# EAGLE design BOTTOM_BRD_v.1.0.2_ (EAGLE 9.6.2)
NYU Shanghai Swarm Robotics 2020
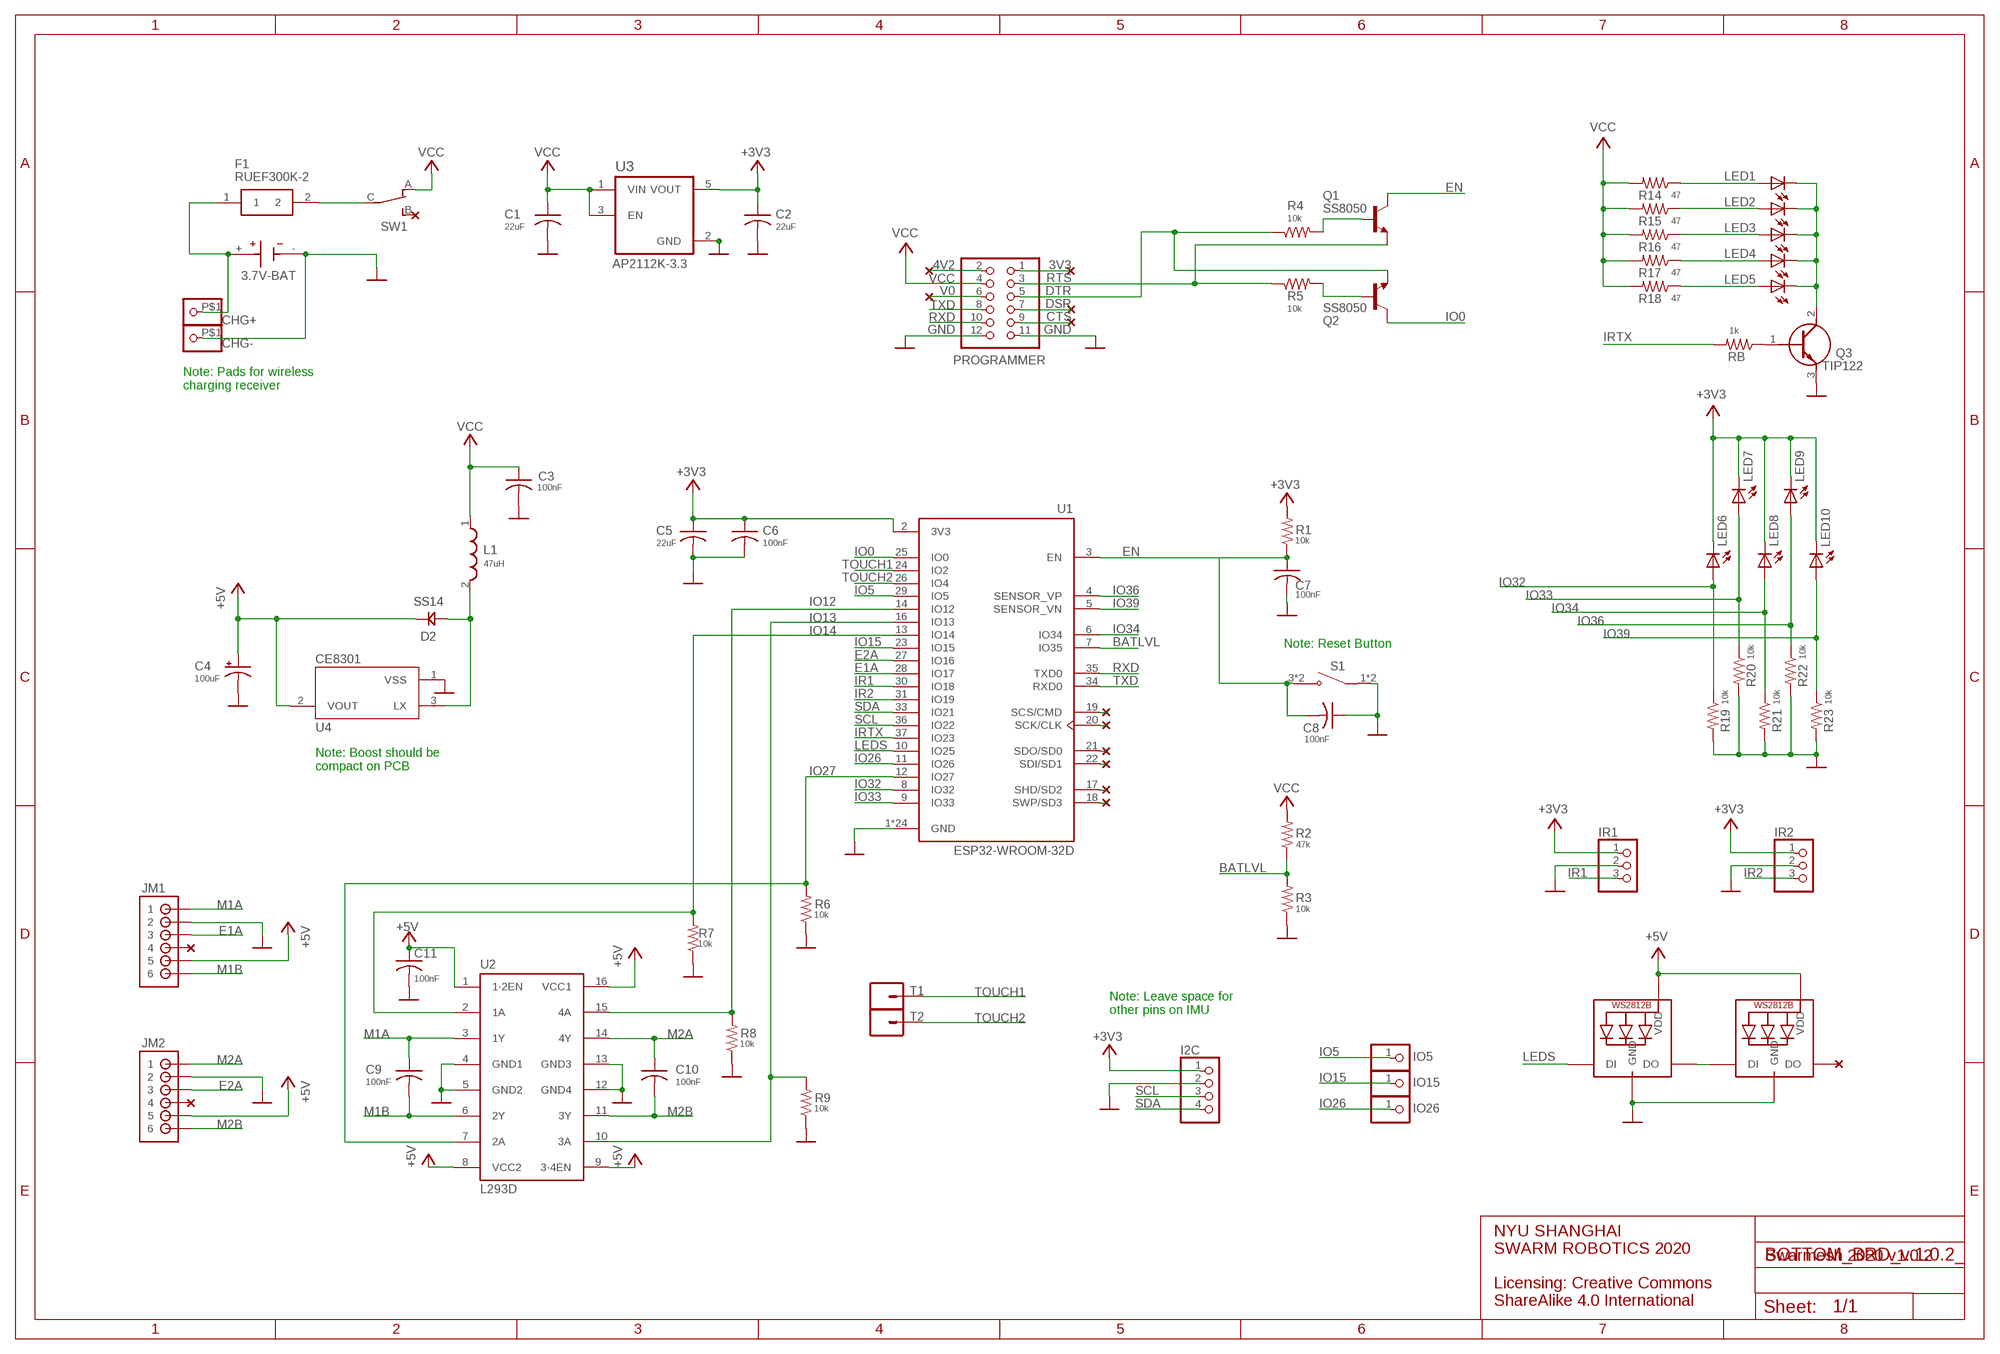
[diagram p0: schematic, sheet 1]

## Parts
BT1  3.7V-BAT  6S-AA  [BAT_6S-AA]
C1  22uF  C-USC0805  [C0805]
C2  22uF  C-USC0805  [C0805]
C3  100nF  C-USC0805  [C0805]
C4  100uF  CPOL-US153CLV-0605  [153CLV-0605]
C5  22uF  C-USC0805  [C0805]
C6  100nF  C-USC0805  [C0805]
C7  100nF  C-USC0805  [C0805]
C8  100nF  C-USC0805  [C0805]
C9  100nF  C-USC0805  [C0805]
C10  100nF  C-USC0805  [C0805]
C11  100nF  C-USC0805  [C0805]
CHARGING  WS2812B5050  [WS2812B]
CHG+  PINHD-1X1-BIGPOGO  [1X1-BIGPOGO]
CHG-  PINHD-1X1-BIGPOGO  [1X1-BIGPOGO]
D2  SS14  [DO214]
F1  RUEF300K-2  [RUEF300K2]
I2C  PINHD-1X4  [1X04]
IO5  PINHD-1X1  [1X01]
IO15  PINHD-1X1  [1X01]
IO26  PINHD-1X1  [1X01]
IR1  PINHD-1X3  [1X03]
IR2  PINHD-1X3  [1X03]
JM1  B6B-ZR  [B6B-ZR]
JM2  B6B-ZR  [B6B-ZR]
L1  47uH  SDR0604-100KL  [INDP5858X480N]
LED1  LED5MM  [LED5MM]
LED2  LED5MM  [LED5MM]
LED3  LED5MM  [LED5MM]
LED4  LED5MM  [LED5MM]
LED5  LED5MM  [LED5MM]
LED6  LED5MM  [LED5MM]
LED7  LED5MM  [LED5MM]
LED8  LED5MM  [LED5MM]
LED9  LED5MM  [LED5MM]
LED10  LED5MM  [LED5MM]
PROGRAMMER  PINHD-2X6  [2X06]
Q1  SS8050  BC850  [SOT23]
Q2  SS8050  BC850  [SOT23]
Q3  TIP122  [TO270P460X1020X2008-3P]
R1  10k  R-US_M0805  [M0805]
R2  47k  R-US_M0805  [M0805]
R3  10k  R-US_M0805  [M0805]
R4  10k  R-US_M0805  [M0805]
R5  10k  R-US_M0805  [M0805]
R6  10k  R-US_M0805  [M0805]
R7  10k  R-US_M0805  [M0805]
R8  10k  R-US_M0805  [M0805]
R9  10k  R-US_M0805  [M0805]
R14  47  R-US_M0805  [M0805]
R15  47  R-US_M0805  [M0805]
R16  47  R-US_M0805  [M0805]
R17  47  R-US_M0805  [M0805]
R18  47  R-US_M0805  [M0805]
R19  10k  R-US_M0805  [M0805]
R20  10k  R-US_M0805  [M0805]
R21  10k  R-US_M0805  [M0805]
R22  10k  R-US_M0805  [M0805]
R23  10k  R-US_M0805  [M0805]
RB  1k  R-US_M0805  [M0805]
S1  2-1437565-9  [SW_2-1437565-9]
STATE  WS2812B5050  [WS2812B]
SW1  CS12ANW03  [CS12ANW03]
T1  CONN_01SPRING-CONN  [SPRING-CONNECTOR]
T2  CONN_01SPRING-CONN  [SPRING-CONNECTOR]
U1  ESP32-WROOM-32D  [MODULE_ESP32-WROOM-32D]
U2  L293D  [DIL16]
U3  AP2112K-3.3  AP2112K-3.3TRG1  [SOT95P285X140-5N]
U4  CE8301  MCP1702T-3302E/MB  [REG_MCP1702T-3302E/MB]

## Nets
3V3: PROGRAMMER.1
4V2: PROGRAMMER.2
+3V3: C2.1 C5.1 C6.1 I2C.1 IR1.1 IR2.1 LED6.K(C) LED7.K(C) LED8.K(C) LED9.K(C) LED10.K(C) R1.2 U1.2(3V3) U3.5(VOUT)
+5V: C4.+ C11.1 CHARGING.1-VDD(VDD) D2.CATHODE(KATHODE) JM1.5 JM2.5 STATE.1-VDD(VDD) U2.1(1-2EN) U2.8(VCC2) U2.9(3-4EN) U2.16(VCC1) U4.2(VOUT)
BATLVL: R2.1 R3.2 U1.7(IO35)
CTS: PROGRAMMER.9
DSR: PROGRAMMER.7
DTR: PROGRAMMER.5 Q2.2(E) R4.1
E1A: JM1.3 U1.28(IO17)
E2A: JM2.3 U1.27(IO16)
EN: C7.1 C8.2 Q1.3(C) R1.1 S1.3(NO) S1.4(NO) U1.3(EN)
GND: BT1.- C1.2 C2.2 C3.2 C4.- C5.2 C6.2 C7.2 C8.1 C11.2 CHARGING.3-GND(GND) CHG-.P$1 I2C.2 IR1.2 IR2.2 JM1.2 JM2.2 PROGRAMMER.11 PROGRAMMER.12 Q3.3(E) R3.1 R6.1 R7.1 R8.1 R9.1 R19.2 R20.2 R21.2 R22.2 R23.2 S1.1(COM) S1.2(COM) STATE.3-GND(GND) U1.1(GND) U1.15(GND) U1.38(GND) U1.39_1(GND) U1.39_2(GND) U1.39_3(GND) U1.39_4(GND) U1.39_5(GND) U1.39_6(GND) U1.39_7(GND) U1.39_8(GND) U1.39_9(GND) U1.39_10(GND) U1.39_11(GND) U1.39_12(GND) U1.39_13(GND) U1.39_14(GND) U1.39_15(GND) U1.39_16(GND) U1.39_17(GND) U1.39_18(GND) U1.39_19(GND) U1.39_20(GND) U1.39_21(GND) U2.4(GND1) U2.5(GND2) U2.12(GND4) U2.13(GND3) U3.2(GND) U4.1(VSS)
IO0: Q2.3(C) U1.25(IO0)
IO5: IO5.1 U1.29(IO5)
IO12: R8.2 U1.14(IO12) U2.15(4A)
IO13: R9.2 U1.16(IO13) U2.10(3A)
IO14: R7.2 U1.13(IO14) U2.2(1A)
IO15: IO15.1 U1.23(IO15)
IO26: IO26.1 U1.11(IO26)
IO27: R6.2 U1.12(IO27) U2.7(2A)
IO32: LED6.A R19.1 U1.8(IO32)
IO33: LED7.A R20.1 U1.9(IO33)
IO34: LED8.A R21.1 U1.6(IO34)
IO36: LED9.A R22.1 U1.4(SENSOR_VP)
IO39: LED10.A R23.1 U1.5(SENSOR_VN)
IR1: IR1.3 U1.30(IO18)
IR2: IR2.3 U1.31(IO19)
IRTX: RB.2 U1.37(IO23)
LEDS: CHARGING.4-DIN(DI) U1.10(IO25)
M1A: C9.1 JM1.1 U2.3(1Y)
M1B: C9.2 JM1.6 U2.6(2Y)
M2A: C10.1 JM2.1 U2.14(4Y)
M2B: C10.2 JM2.6 U2.11(3Y)
N$1: BT1.+ CHG+.P$1 F1.1
N$3: F1.2 SW1.C
N$4: D2.ANODE L1.2 U4.3(LX)
N$5: U1.19(SCS/CMD)
N$6: LED5.A R18.1
N$7: LED4.A R17.1
N$8: LED3.A R16.1
N$9: CHARGING.2-DOUT(DO) STATE.4-DIN(DI)
N$11: LED1.A R14.1
N$12: Q1.1(B) R4.2
N$14: LED2.A R15.1
N$15: Q2.1(B) R5.2
N$16: U1.20(SCK/CLK)
N$18: U1.21(SDO/SD0)
N$19: LED1.K(C) LED2.K(C) LED3.K(C) LED4.K(C) LED5.K(C) Q3.2(C)
N$23: U1.22(SDI/SD1)
N$24: U1.17(SHD/SD2)
N$25: U1.18(SWP/SD3)
N$26: Q3.1(B) RB.1
RTS: PROGRAMMER.3 Q1.2(E) R5.1
RXD: PROGRAMMER.10 U1.35(TXD0)
SCL: I2C.3 U1.36(IO22)
SDA: I2C.4 U1.33(IO21)
TOUCH1: T1.P$2 U1.24(IO2)
TOUCH2: T2.P$2 U1.26(IO4)
TXD: PROGRAMMER.8 U1.34(RXD0)
V0: PROGRAMMER.6
VCC: C1.1 C3.1 L1.1 PROGRAMMER.4 R2.2 R14.2 R15.2 R16.2 R17.2 R18.2 SW1.A U3.1(VIN) U3.3(EN)
Unconnected: JM1.4 JM2.4 STATE.2-DOUT(DO) SW1.B

## Notes on the sheet
- Note: Pads for wireless 
  charging receiver
- Note: Reset Button
- Note: Boost should be
  compact on PCB
- Note: Leave space for 
  other pins on IMU
- Swarmesh 2020 v1.0.2
- NYU SHANGHAI
  SWARM ROBOTICS 2020
  
  Licensing: Creative Commons
  ShareAlike 4.0 International

## Library data of the parts
BT1 = 6S-AA:6S-AA; AVAILABILITY: Unavailable; DESCRIPTION: BATTERY HOLDER AA PC PIN; DIGIKEY-PURCHASE-URL: https://snapeda.com/shop?store=DigiKey&id=4389101; MF: MPD; MP: 6S-AA; PACKAGE: None; PRICE: None
C1-C3 C5-C11 = rcl:C-US: CAPACITOR, American symbol; SPICEPREFIX: C
C4 = rcl:CPOL-US: POLARIZED CAPACITOR, American symbol; SPICEPREFIX: C
CHARGING STATE = adafruit:WS2812B
CHG+ CHG- = adafruit:PINHD-1X1: Pin header 1x1 for 0.1" spacing With round pins
D2 = SS14:SS14; AVAILABILITY: Unavailable; DESCRIPTION: Diode Schottky 40V 1A Surface Mount SMA (DO-214AC); DIGIKEY-PURCHASE-URL: https://snapeda.com/shop?store=DigiKey&id=229686; MF: ON Semiconductor; MP: SS14; PACKAGE: DO-214AC-214 ON Semiconductor; PRICE: None
F1 = RUEF300K-2:RUEF300K-2: TE CONNECTIVITY / RAYCHEM - RUEF300K-2 - RESETTABLE FUSE, PTC, 30V, 3A, RADIAL Source: Datasheet <http://www.farnell.com/datasheets/1482689.pdf>; DESCRIPTION: TE CONNECTIVITY / RAYCHEM - RUEF300K-2 - RESETTABLE FUSE, PTC, 30V, 3A, RADIAL; HEIGHT: 16.5mm; MANUFACTURER_NAME: TE CONNECTIVITY / RAYCHEM; MANUFACTURER_PART_NUMBER: RUEF300K-2
I2C = pinhead:PINHD-1X4: PIN HEADER
IO5 IO15 IO26 = pinhead:PINHD-1X1: PIN HEADER
IR1 IR2 = adafruit:PINHD-1X3: PIN HEADER
JM1 JM2 = B6B-ZR:B6B-ZR: JST-ZH Connector 6 pol, 1.5mm pitch Package: B6B-ZR Source: http://www.jst-mfg.com/product/pdf/eng/eZH.pdf; AVAILABILITY: Unavailable; DESCRIPTION: Connector Header Surface Mount 6 position 0.059 _1.50mm_; MF: JST; MP: B6B-ZR; PACKAGE: None; PRICE: None
L1 = SDR0604-100KL:SDR0604-100KL: Inductor Power Wirewound 120uH 10% 1KHz 22Q-Factor Ferrite 480mA 930mOhm DCR T/R; AVAILABILITY: Unavailable; DESCRIPTION: 10µH Unshielded Wirewound Inductor Nonstandard; MF: Bourns; MP: SDR0604-100KL; PACKAGE: Nonstandard Bourns; PRICE: None
LED1-LED10 = LEDc:LED: LED OSRAM: - CHIPLED LG R971, LG N971, LY N971, LG Q971, LY Q971, LO R971, LY R971 LH N974, LH R974 LS Q976, LO Q976, LY Q976 LO Q996 - Hyper CHIPLED LW Q18S LB Q993, LB Q99A, LB R99A - SideLED LS A670, LO A670, LY A670, LG A670, LP A670 LB A673, LV A673, LT A673, LW A673 LH A674 LY A675 LS A676, LA A676, LO A676, LY A676, LW A676 LS A679, LY A679, LG A679 - Hyper Micro SIDELED® LS Y876, LA Y876, LO Y876, LY Y876 LT Y87S - SmartLED LW L88C, LW L88S LB L89C, LB L89S, LG L890 LS L89K, LO L89K, LY L89K LS L896, LA L896, LO L896, LY L896 - TOPLED LS T670, LO T670, LY T670, LG T670, LP T670 LSG T670, LSP T670, LSY T670, LOP T670, LYG T670 LG T671, LOG T671, LSG T671 LB T673, LV T673, LT T673, LW T673 LH T674 LS T676, LA T676, LO T676, LY T676, LB T676, LH T676, LSB T676, LW T676 LB T67C, LV T67C, LT T67C, LS T67K, LO T67K, LY T67K, LW E67C LS E67B, LA E67B, LO E67B, LY E67B, LB E67C, LV E67C, LT E67C LW T67C LS T679, LY T679, LG T679 LS T770, LO T770, LY T770, LG T770, LP T770 LB T773, LV T773, LT T773, LW T773 LH T774 LS E675, LA E675, LY E675, LS T675 LS T776, LA T776, LO T776, LY T776, LB T776 LHGB T686 LT T68C, LB T68C - Hyper Mini TOPLED® LB M676 - Mini TOPLED Santana® LG M470 LS M47K, LO M47K, LY M47K Source: http://www.osram.convergy.de/
PROGRAMMER = pinhead:PINHD-2X6: PIN HEADER
Q1 Q2 = transistor:BC850: NPN TRANSISTOR
Q3 = TIP122:TIP122: TIP122, Darlington Transistor, NPN 8 A 100 V HFE:1000, 3-Pin, TO-220 Source: Datasheet <https://componentsearchengine.com/Datasheets/1/TIP122.pdf>; DESCRIPTION: TIP122, Darlington Transistor, NPN 8 A 100 V HFE:1000, 3-Pin, TO-220; HEIGHT: 4.6mm; MANUFACTURER_NAME: STMicroelectronics; MANUFACTURER_PART_NUMBER: TIP122; MOUSER_PART_NUMBER: 511-TIP122; MOUSER_PRICE-STOCK: https://www.mouser.com/Search/Refine.aspx?Keyword=511-TIP122
R1-R9 R14-R23 RB = rcl:R-US_: RESISTOR, American symbol; SPICEPREFIX: R
S1 = pushswitch:2-1437565-9; AVAILABILITY: Unavailable; COMMENT: 2-1437565-9; DESCRIPTION: Tactile Switch SPST-NO Top Actuated Surface Mount; MF: TE Connectivity; MP: 2-1437565-9; PACKAGE: SMD-6 Omron Electronics; PRICE: None
SW1 = SWITCH_C:CS12ANW03; AVAILABILITY: Unavailable; DESCRIPTION: Slide Switch SPDT Through Hole; DIGIKEY-PURCHASE-URL: https://snapeda.com/shop?store=DigiKey&id=478299; MF: NKK Switches; MP: CS12ANW03; PACKAGE: None; PRICE: None
T1 T2 = Touch_Pad:CONN_01: Single connection point. Often used as Generic Header-pin footprint for 0.1 inch spaced/style header connections On any of the 0.1 inch spaced packages, you can populate with these: Break Away Headers - Straight <https://www.sparkfun.com/products/116> (PRT-00116) Break Away Male Headers - Right Angle <https://www.sparkfun.com/products/553> (PRT-00553) Female Headers <https://www.sparkfun.com/products/115> (PRT-00115) Break Away Headers - Machine Pin <https://www.sparkfun.com/products/117> (PRT-00117) Break Away Female Headers - Swiss Machine Pin <https://www.sparkfun.com/products/743> (PRT-00743) This device is also useful as a general connection point to wire up your design to another part of your project. Our various solder wires solder well into these plated through hole pads. Hook-Up Wire - Assortment (Stranded, 22 AWG) <https://www.sparkfun.com/products/11375> (PRT-11375) Hook-Up Wire - Assortment (Solid Core, 22 AWG) <https://www.sparkfun.com/products/11367> (PRT-11367) View the entire wire category on our website here <https://www.sparkfun.com/categories/141> Special notes: SMTSO-256-ET is a "flush mount" nut for a 4-40 screw. We mostly use this on specialty testbeds; it is a nice way to connect hardware to your PCB at an adjustable hieght. Also note, the SNAP packages are for using a snappable style connector. We sell a baggie of snaps and they are also used on two LilyPad designs: Snap Assortment - 30 pack (male and female) <https://www.sparkfun.com/products/11347> (DEV-11347) LilyPad Arduino SimpleSnap <https://www.sparkfun.com/products/10941> (DEV-10941) LilyPad SimpleSnap Protoboard <https://www.sparkfun.com/products/10940> (DEV-10940); SF_ID: PRT-11822
U1 = ESP32-WROOM-32D:ESP32-WROOM-32D: Bluetooth, WiFi 802.11b/g/n, Bluetooth v4.2 + EDR, Class 1, 2 and 3 Transceiver Module 2.4GHz ~ 2.5GHz Integrated, Trace Surface Mount; AVAILABILITY: Unavailable; DESCRIPTION: Bluetooth, WiFi 802.11b/g/n, Bluetooth v4.2 +EDR, Class 1, 2 and 3 Transceiver Module 2.4GHz ~ 2.5GHz Integrated, Trace Surface Mount; MF: Espressif Systems; MP: ESP32-WROOM-32D; PACKAGE: Module Espressif Systems; PRICE: None
U2 = st-microelectronics:L293D: PUSH-PULL 4 CHANNEL DRIVER; MPN: L293D; OC_FARNELL: 9589619; OC_NEWARK: 56P8249
U3 = AP2112K-3.3TRG1:AP2112K-3.3TRG1: AP2112 Series 0.6 A 3.3 V Fixed Output SMT LDO Linear Regulator - SOT23-5; AVAILABILITY: Unavailable; DESCRIPTION: Linear Voltage Regulator IC 1 Output 600mA SOT-25; MF: Diodes Inc.; MP: AP2112K-3.3TRG1; PACKAGE: SOT-753 Diodes Inc.; PRICE: None
U4 = MCP1702T-3302E_MB:MCP1702T-3302E/MB: MCP1702 Series 250 mA 3.3 V Fixed Output Surface Mount LDO Regulator - SOT-89; AVAILABILITY: Unavailable; DESCRIPTION: Linear Voltage Regulator IC 1 Output 250mA SOT-89-3; MF: Microchip; MP: MCP1702T-3302E/MB; PACKAGE: SOT-89 Microchip; PRICE: None

## Board
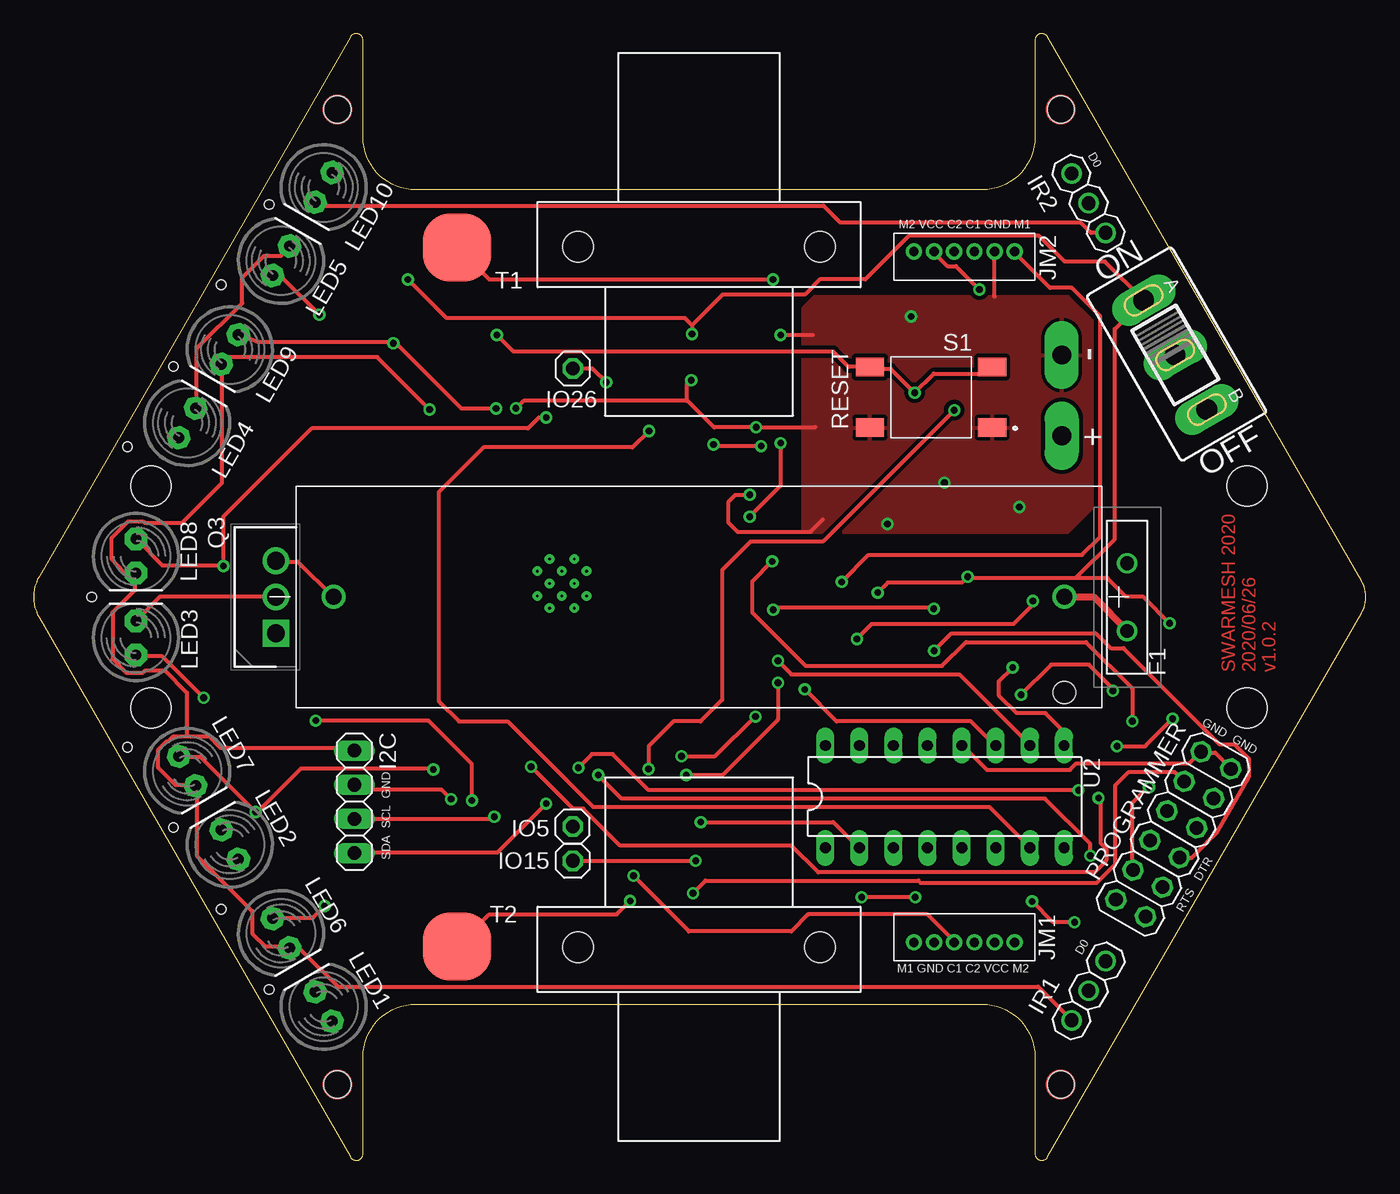
[diagram p1: board, top side]
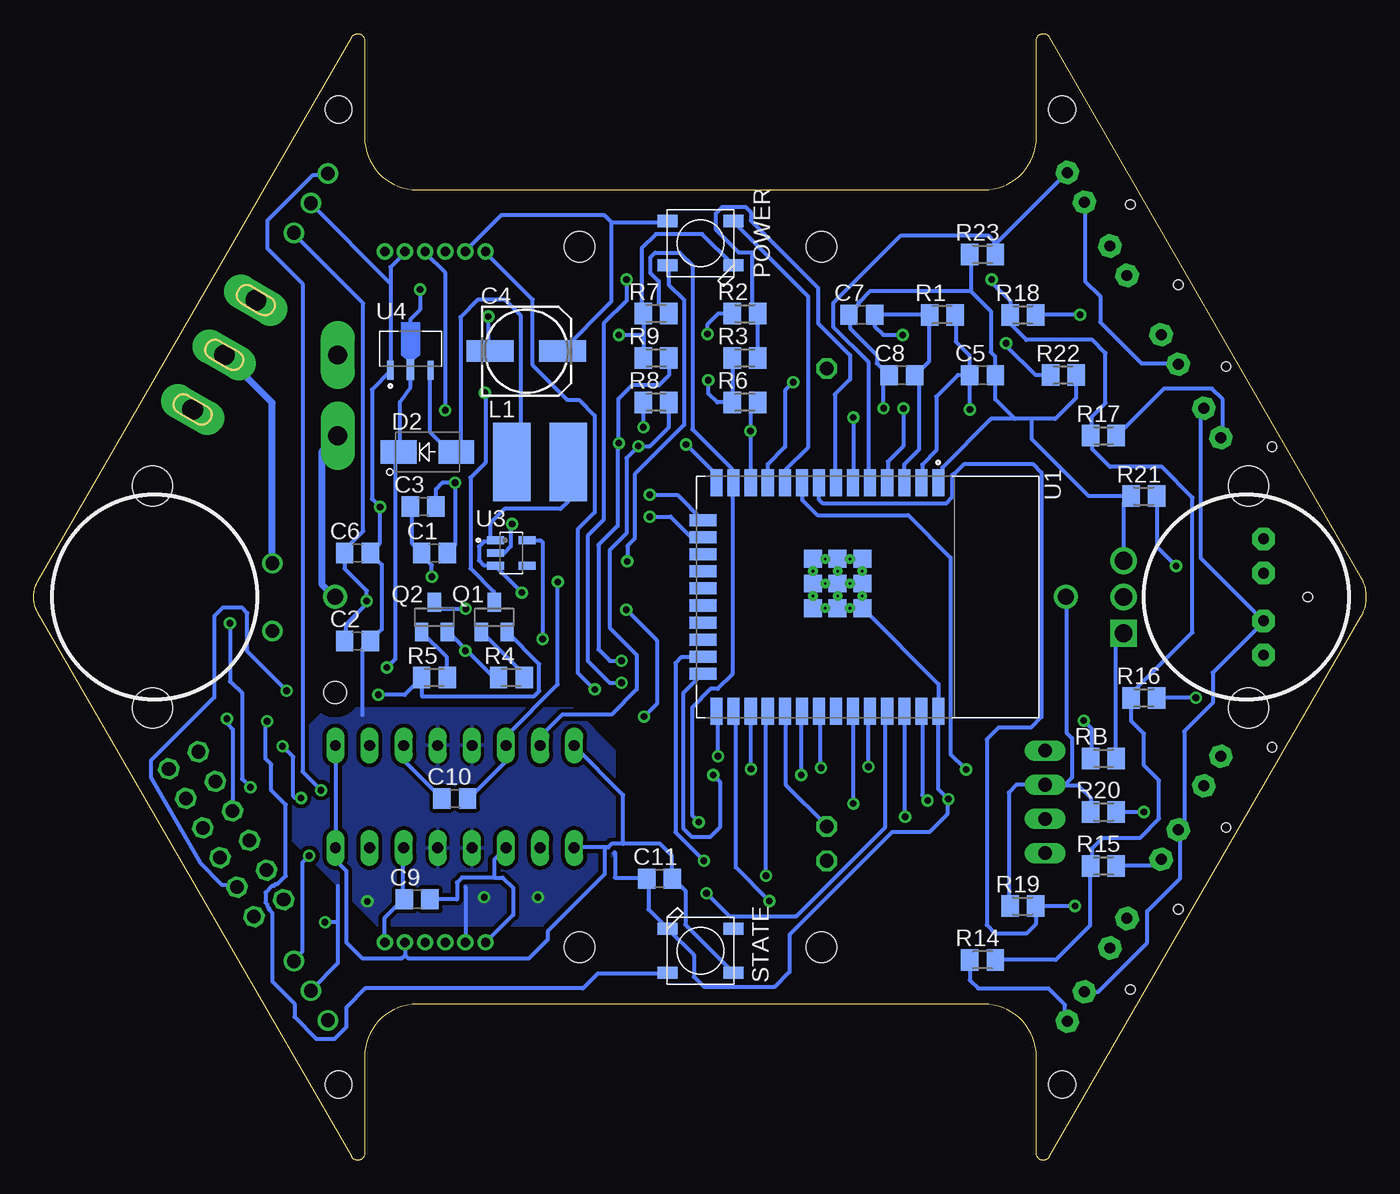
[diagram p2: board, bottom side, seen from below]

Size 99.17 x 83.84 mm. Coordinates in mm from the lower left corner, seen from the top.
Outline: 98.86,43.08 75.47,83.59 arc150 74.53,83.34 74.53,76.13 arc-90 70.62,72.22 28.44,72.22 arc-90 24.53,76.13 24.53,83.34 arc150 23.59,83.59 0.41,43.44 arc60 0.41,40.4 23.59,0.25 arc150 24.53,0.5 24.53,7.71 arc-90 28.44,11.62 70.62,11.62 arc-90 74.53,7.71 74.53,0.5 arc150 75.47,0.25 98.86,40.76 arc60 98.86,43.08
Copper layers (1*16): Top 0.035mm / dielectric 0.15mm / Bottom 0.035mm
Design rules "default *": minimum track width 12mil, minimum drill 0.5mm, track to track 12mil, track to pad 12mil, pad to pad 12mil, via to via 20mil, smd to smd 12mil, copper to edge 40mil, drill to drill 25mil, minimum pad ring 10mil, minimum via ring 8mil, stop-mask expansion 4mil, vias tented up to drill 0mil, thermal gap 10mil
Holes 2 mm at 76.46,78.19 22.61,78.19 22.61,5.65 76.46,5.65
Holes 3 mm at 8.73,50.17 8.73,33.67 90.33,50.17 90.33,33.67
Holes 2.3 mm at 58.53,15.86 40.53,15.86 40.53,67.98 58.53,67.98
Holes 0.7 mm at 17.53,12.71 4.32,41.92 13.97,18.68 10.41,24.78 6.98,30.74 6.98,53.1 10.41,59.07 13.97,65.16 17.53,71.13
tKeepout: area 74.8,76.6 to 78.1,79.8; area 21,76.6 to 24.2,79.8; area 21,4 to 24.2,7.3; area 74.8,4 to 78.1,7.3

### Footprints (pad centres in the part's own frame; a part is rotated, then mirrored left to right if it is on the bottom)
BAT_6S-AA = drill 1.19: + -27.2,0; - 27.2,0 | hole 1.67: -27.2,7.1
C0805 = smd 1.3 x 1.5: 1 -0.95,0; 2 0.95,0
153CLV-0605 = smd 3.5 x 1.6: + 2.7,0; - -2.7,0
WS2812B = smd 1.5 x 0.9: 1-VDD 2.45,-1.65; 2-DOUT 2.45,1.65; 3-GND -2.45,1.65; 4-DIN -2.45,-1.65
1X1-BIGPOGO = drill 1.4 pad 2.54 long: P$1 0,0
DO214 = smd 2.65 x 1.75: ANODE -2.15,0; CATHODE 2.15,0
RUEF300K2 = drill 1.01 pad 1.515: 1 0,0; 2 5.05,0
1X04 = drill 1.016 long: 1 -3.81,0; 2 -1.27,0; 3 1.27,0; 4 3.81,0
1X01 = drill 1.016 octagon: 1 0,0
1X03 = drill 1.016: 1 -2.54,0; 2 0,0; 3 2.54,0
B6B-ZR = drill 0.7: 1 9,-1.3; 2 7.5,-1.3; 3 6,-1.3; 4 4.5,-1.3; 5 3,-1.3; 6 1.5,-1.3
INDP5858X480N = smd 2.8 x 5.85: 1 -2.1,0; 2 2.1,0
LED5MM = drill 0.813 pad 1.676 octagon: A -1.27,0; K 1.27,0
2X06 = drill 1.016 octagon: 1 -6.35,-1.27; 2 -6.35,1.27; 3 -3.81,-1.27; 4 -3.81,1.27; 5 -1.27,-1.27; 6 -1.27,1.27; 7 1.27,-1.27; 8 1.27,1.27; 9 3.81,-1.27; 10 3.81,1.27; 11 6.35,-1.27; 12 6.35,1.27
SOT23 = smd 1 x 1.4: 1 -0.95,-1.1; 2 0.95,-1.1; 3 0,1.1
TO270P460X1020X2008-3P = drill 1.32 pad 1.98 square: 1 0,0 | drill 1.32 pad 1.98: 2 2.7,0; 3 5.4,0
M0805 = smd 1.3 x 1.6: 1 -0.95,0; 2 0.95,0
SW_2-1437565-9 = smd 2.1 x 1.4: 1 -4.55,2.25; 2 4.55,2.25; 3 -4.55,-2.25; 4 4.55,-2.25
CS12ANW03 = drill 1.54 pad 2.54 long: A -4.674,0; B 4.724,0; C 0.025,0
SPRING-CONNECTOR = smd 5.08 x 5.08: P$2 0,0
MODULE_ESP32-WROOM-32D = smd 2 x 0.9: 1 -8.5,5.26; 2 -8.5,3.99; 3 -8.5,2.72; 4 -8.5,1.45; 5 -8.5,0.18; 6 -8.5,-1.09; 7 -8.5,-2.36; 8 -8.5,-3.63; 9 -8.5,-4.9; 10 -8.5,-6.17; 11 -8.5,-7.44; 12 -8.5,-8.71; 13 -8.5,-9.98; 14 -8.5,-11.25; 25 8.5,-11.25; 26 8.5,-9.98; 27 8.5,-8.71; 28 8.5,-7.44; 29 8.5,-6.17; 30 8.5,-4.9; 31 8.5,-3.63; 32 8.5,-2.36; 33 8.5,-1.09; 34 8.5,0.18; 35 8.5,1.45; 36 8.5,2.72; 37 8.5,3.99; 38 8.5,5.26 | smd 0.9 x 2: 15 -5.715,-12.25; 16 -4.445,-12.25; 17 -3.175,-12.25; 18 -1.905,-12.25; 19 -0.635,-12.25; 20 0.635,-12.25; 21 1.905,-12.25; 22 3.175,-12.25; 23 4.445,-12.25; 24 5.715,-12.25 | smd 1.33 x 1.33: 39_1 -2.835,-0.405; 39_2 -1,-0.405; 39_3 0.835,-0.405; 39_4 -2.835,-2.24; 39_5 -1,-2.24; 39_6 0.835,-2.24; 39_7 -2.835,-4.075; 39_8 -1,-4.075; 39_9 0.835,-4.075 | drill 0.2 pad 0.3: 39_10 -1.917,-0.405; 39_11 -0.083,-0.405; 39_12 -2.835,-1.323; 39_13 -1,-1.323; 39_14 0.835,-1.323; 39_15 -1.917,-2.24; 39_16 -0.083,-2.24; 39_17 -2.835,-3.158; 39_18 -1,-3.158; 39_19 0.835,-3.158; 39_20 -1.917,-4.075; 39_21 -0.083,-4.075
DIL16 = drill 0.813 long: 1 -8.89,-3.81; 2 -6.35,-3.81; 3 -3.81,-3.81; 4 -1.27,-3.81; 5 1.27,-3.81; 6 3.81,-3.81; 7 6.35,-3.81; 8 8.89,-3.81; 9 8.89,3.81; 10 6.35,3.81; 11 3.81,3.81; 12 1.27,3.81; 13 -1.27,3.81; 14 -3.81,3.81; 15 -6.35,3.81; 16 -8.89,3.81
SOT95P285X140-5N = smd 1.35 x 0.6: 1 -1.185,0.95; 2 -1.185,0; 3 -1.185,-0.95; 4 1.185,-0.95; 5 1.185,0.95
REG_MCP1702T-3302E/MB = smd 1.4 x 0.48: 1 -1.425,1.5; 3 -1.425,-1.5 | smd 1.525 x 0.56: 2 -1.365,0

### Placement (x,y rotation side)
BT1  49.53,41.92 180 top
C1  69.34,45.19 0 bottom
C2  75.07,38.65 0 bottom
C3  70.17,48.65 0 bottom
C4  62.48,60.21 0 bottom
C5  28.53,58.42 0 bottom
C6  75.07,45.19 0 bottom
C7  37.53,62.92 180 bottom
C8  34.53,58.42 0 bottom
C9  70.61,19.42 180 bottom
C10  67.82,26.92 180 bottom
C11  52.58,20.97 180 bottom
CHARGING  49.53,68.24 180 bottom
CHG+  76.53,53.92 270 bottom
CHG-  76.53,59.92 90 top
D2  69.85,52.72 180 bottom
F1  81.41,39.38 90 top
I2C  23.88,26.68 270 top
IO5  40.13,24.84 180 top
IO15  40.13,22.29 0 top
IO26  40.13,58.92 0 top
IR1  78.53,12.62 60 top
IR2  78.53,71.22 120 top
JM1  74.53,14.92 180 top
JM2  64.03,68.92 0 top
L1  61.47,51.95 180 bottom
LED1  21.59,11.44 120 top
LED2  14.6,23.51 120 top
LED3  7.62,38.87 90 top
LED4  11.43,54.87 60 top
LED5  18.41,66.94 60 top
LED6  18.41,16.9 300 top
LED7  11.43,28.97 300 top
LED8  7.62,44.97 270 top
LED9  14.6,60.34 240 top
LED10  21.59,72.4 240 top
PROGRAMMER  84.84,24.27 60 top
Q1  64.88,40.42 0 bottom
Q2  69.34,40.42 0 bottom
Q3  18.03,39.22 90 top
R1  31.53,62.92 0 bottom
R2  46.23,63 180 bottom
R3  46.23,59.7 0 bottom
R4  63.61,35.92 0 bottom
R5  69.34,35.92 0 bottom
R6  46.23,56.4 0 bottom
R7  52.83,63 0 bottom
R8  52.83,56.4 0 bottom
R9  52.83,59.7 0 bottom
R14  28.53,14.92 0 bottom
R15  19.53,21.92 180 bottom
R16  16.53,34.42 180 bottom
R17  19.53,53.92 180 bottom
R18  25.53,62.92 180 bottom
R19  25.53,18.92 180 bottom
R20  19.53,25.92 180 bottom
R21  16.53,49.42 180 bottom
R22  22.53,58.42 0 bottom
R23  28.53,67.42 180 bottom
RB  19.53,29.92 180 bottom
S1  66.8,56.78 180 top
STATE  49.53,15.6 0 bottom
SW1  84.96,59.95 300 top
T1  31.53,67.92 0 top
T2  31.53,15.92 0 top
U1  37.08,41.92 270 bottom
U2  67.82,27.06 0 top
U3  63.61,45.19 0 bottom
U4  71.12,60.21 90 bottom

### Tracks (layer width: path | path; a pad name or v marks a point on that pad's centre or on a via)
4V2
  Top 0.305: 80.65,19.3 PROGRAMMER.2
+3V3  (via drill 0.5)
  Top 0.305: v74.38,41.62 74.38,41.35 72.93,39.9 62.38,39.9 v61.28,38.8 | v29.48,55.87 25.58,59.77 14.5,59.77 LED9.K 14.03,59.05 14.03,50.42 11.03,47.42 8.28,47.42 8.15,47.55 7.03,47.55 5.83,46.35 5.83,44.73 6.79,43.7 LED8.K 7.53,43.67 7.53,42.42 5.88,40.77 5.88,37.32 6.9,36.3 8.15,36.3 8.28,36.42 9.78,36.42 11.4,34.8 11.4,31.55 | 11.4,31.55 10.4,31.55 10.03,31.17 9.9,31.17 9.28,30.55 9.28,29.22 10.58,27.92 12.03,27.92 LED7.K 12.15,27.8 12.15,22.67 16.28,18.55 16.28,16.87 17.23,15.92 19.03,15.92 LED6.K 19.15,15.8 19.78,15.8 22.65,12.92 74.78,12.92 77.15,10.55 IR1.1 | IR2.1 78.7,69.02 77.93,69.8 60.03,69.8 58.78,71.05 21.28,71.05 21.03,71.3 LED10.K | 11.4,31.55 13.05,31.55 13.88,30.72 23.65,30.72 I2C.1
  Bottom 0.305: C2.1 75.9,38.67 75.9,39.9 74.38,41.42 v74.38,41.62 74.38,42.4 76.02,44.04 C6.1 75.9,45.3 75.9,45.55 74.63,46.82 74.63,63.77 79.78,68.92 IR2.1 | C5.1 29.48,59.87 30.53,60.92 30.53,62.92 R1.2 | U1.2 33.03,50.42 33.03,51.77 31.98,52.82 31.98,56.82 30.38,58.42 C5.1 | LED9.K 14.03,59.3 16.7,59.3 19.78,62.37 19.78,64.3 20.9,65.42 20.9,71.3 LED10.K | 29.48,55.82 v29.48,55.87 C5.1 | U3.5 61.45,46.14 61.28,45.97 v61.28,38.8
+5V  (via drill 0.5)
  Top 0.305: v70.4,64.8 68.65,66.55 68.03,66.55 67.03,67.55 JM2.5 | U2.9 76.71,31.89 75.33,33.27 73.18,33.27 71.83,34.62 71.83,35.62 v72.88,36.67
  Bottom 0.305: 56.15,69.8 52.03,69.8 CHARGING.1-VDD | 56.15,69.8 56.15,63.92 59.78,60.3 C4.+ | JM2.5 67.03,67.67 64.38,70.32 56.68,70.32 56.15,69.8 | v70.4,64.8 70.4,63.3 71.12,62.58 U4.2 71.12,57.5 71.9,56.43 71.9,52.8 D2.CATHODE 72.25,52.47 72.25,37.3 v72.88,36.67 72.88,36.62 | 71.53,16.17 JM1.5 71.53,15.27 | STATE.1-VDD 47.15,14.05 50.65,17.55 50.65,20.05 51.53,20.92 C11.1 51.65,21.05 51.65,22.67 52.53,23.55 55.28,23.55 | 56.65,23.3 56.4,23.3 56.15,23.55 55.28,23.55 | 56.65,23.3 58.9,23.3 U2.1 | 55.28,23.55 55.28,27.17 58.9,30.8 U2.16 | 56.65,23.3 56.65,21.3 60.9,17.05 60.9,16.42 62.28,15.05 71.3,15.05 71.53,15.27 | 76.65,31.3 76.65,30.92 U2.9 76.65,30.8 76.65,23.3 U2.8 76.65,23.17 76.65,22.3 75.9,21.55 75.9,16.22 74.73,15.05 71.75,15.05 71.53,15.27
BATLVL
  Bottom 0.305: R3.2 45.28,59.8 45.28,62.92 R2.1 45.4,63.05 45.65,63.3 45.65,67.55 46.65,67.55 48.4,69.3 48.4,70.45 47.93,70.92 46.15,70.92 45.78,70.55 45.78,69.92 40.78,64.92 40.78,62.3 38.4,59.92 38.4,58.12 39.53,57 39.53,50.51 U1.7
DTR  (via drill 0.5)
  Top 0.305: v67.03,37.92 68.33,39.22 79.03,39.22 79.06,39.22 80.17,38.11 81.12,38.11 88.26,30.97 89.38,30.97 90.49,29.86 90.49,28.6 88.04,24.36 87.38,23.7 87.37,23.69 87.37,23.68 86.22,22.53 PROGRAMMER.5
  Bottom 0.305: 66.97,37.98 64.9,35.92 R4.1 | 66.97,37.98 68.28,39.3 Q2.2 | v67.03,37.92 66.97,37.98
E1A  (via drill 0.5)
  Top 0.305: v44.65,21.17 48.78,17.05 56.4,17.05 57.65,18.3 66.53,18.3 68.53,16.3 JM1.3
  Bottom 0.305: v44.65,21.17 44.65,33.3 U1.28
E2A  (via drill 0.5)
  Top 0.305: v45.78,29.12 45.78,30.82 47.63,32.67 49.65,32.67 51.25,34.27 51.25,43.92 53.38,46.05 58.75,46.05 v68.53,55.82
  Bottom 0.305: v45.78,29.12 U1.27 | v68.53,55.82 68.55,55.85 68.55,66.07 70.03,67.55 JM2.3
EN  (via drill 0.5)
  Top 0.305: S1.3 71.28,58.92 70.9,58.55 67,58.55 v65.58,57.12 63.78,58.92 62.28,58.92 S1.4 62.15,59.05 60.65,59.05 59.53,60.17 35.73,60.17 v34.48,61.42
  Bottom 0.305: U1.3 34.36,51.79 33.28,52.87 33.28,58.12 C8.2 33.53,58.42 32.53,59.42 32.53,62.92 R1.1 C7.1 36.58,62.07 35.93,61.42 v34.48,61.42 | Q1.3 64.93,41.57 64.93,42.32 66.65,44.05 66.65,50.8 65.53,51.92 65.53,57.07 v65.58,57.12
GND  (via drill 0.5)
  Top 0.305: BT1.- 22.28,41.92 19.65,44.55 18.03,44.55 Q3.3 | v31.07,26.88 30.35,27.6 24.23,27.6 I2C.2 | v53.3,49.52 52.25,49.52 51.69,48.96 51.69,47.48 52.4,46.77 57.83,46.77 58.73,47.67 | 48.6,56.52 48.68,56.52 50.65,54.55 v53.78,54.55 58.15,54.55 58.18,54.57 | v48.95,58.05 48.6,57.7 48.6,56.52 | 71.53,64.27 JM2.2 | 48.6,56.52 36.45,56.52 v35.9,55.97 | v65.63,19.57 v61.63,19.57 | 74.28,19.32 v74.33,19.27 75.88,17.72 v77.48,17.72 | v55.6,61.42 57.98,61.42 | PROGRAMMER.11 89.06,29.22 87.95,30.33 86.99,30.33 PROGRAMMER.12 86.84,30.33 86.04,29.54 77.63,29.54 77.15,29.06 70.96,29.06 69.21,30.81 U2.12
  Bottom 0.305: C5.2 27.58,59.8 27.93,60.15 27.93,63.2 29.4,64.67 | 29.4,64.67 29.4,67.42 R23.2 | 27.53,58.3 C5.2 | U1.1 31.78,50.42 31.53,50.67 31.53,51.55 27.9,55.17 26.13,55.17 | 29.4,64.67 36.9,64.67 37.78,63.8 37.78,63.67 38.4,63.05 C7.2 38.4,62.92 38.4,61.92 36.4,59.92 36.4,59.3 35.53,58.42 C8.1 35.53,58.3 35.9,57.92 v35.9,55.97 | U1.39_12 38.53,44.8 39.28,44.8 U1.39_4 39.4,44.8 40.15,44.8 U1.39_17 40.28,44.8 41.03,44.8 U1.39_7 41.15,44.67 41.15,43.92 U1.39_20 41.15,43.8 41.15,43.05 U1.39_8 | U1.39_2 37.53,42.92 37.53,43.8 U1.39_10 | 37.53,43.92 U1.39_10 | U1.39_2 U1.39_13 | 38.28,44.67 U1.39_12 | U1.39_9 41.15,41.17 41.15,41.92 U1.39_21 41.15,42.05 41.15,42.8 U1.39_8 | U1.39_8 U1.39_18 U1.39_5 39.4,43.05 39.4,43.8 U1.39_15 | U1.39_3 37.53,41.17 37.53,41.92 U1.39_11 37.53,42.05 37.53,42.8 U1.39_2 | U1.39_6 39.4,41.17 39.4,41.92 U1.39_16 | U1.39_6 39.28,41.05 38.53,41.05 U1.39_14 38.28,41.17 37.65,41.17 U1.39_3 | U1.39_19 40.15,41.17 39.53,41.17 U1.39_6 | U1.39_3 37.4,41.05 31.8,35.45 31.8,33.44 U1.38 31.78,33.3 31.85,33.37 31.85,27.66 v31.07,26.88 31.15,26.8 31.15,25.77 32.5,24.42 35.28,24.42 42.9,16.8 42.9,14.02 44,12.92 49.28,12.92 50.02,13.66 50.02,15.28 51.9,17.17 STATE.3-GND 52.03,17.3 53.4,18.67 53.4,20.92 C11.2 53.65,21.05 55.9,21.05 55.9,22.8 | Q3.3 18.03,48.92 17.53,49.42 R21.2 | 23.78,28.05 I2C.2 | BT1.- 22.28,41.92 22.28,31.82 21.88,31.42 21.88,28.47 22.4,27.95 I2C.2 | 17.9,49.17 R21.2 | 72.6,65.25 72.6,66.47 71.53,67.55 JM2.2 | 72.6,65.25 72.6,58.79 U4.1 72.65,58.67 73.98,57.35 73.98,49.22 v73.38,48.62 | 72.6,65.25 78.53,71.17 IR2.2 | CHARGING.3-GND 47.15,66.67 49.4,68.92 52.85,68.92 53.9,67.87 53.9,63.05 R7.1 53.78,62.92 53.78,61.42
  Bottom 0.305: 53.78,61.42 53.78,59.8 R9.1 | C3.2 69.22,49.95 68.75,50.42 v67.8,50.42 67.8,45.78 C1.2 | R3.1 47.15,59.67 47.15,56.42 R6.1 48.28,56.4 48.95,57.08 v48.95,58.05 | v53.78,54.55 53.78,56.3 R8.1 | v53.3,49.52 51.25,49.52 49.4,47.67 U1.15 | v65.33,62.8 65.33,60.34 C4.- | v55.6,61.42 53.78,61.42 | C6.2 73.25,44.33 73.25,39.52 C2.2 74.7,38.07 74.7,33.14 | 67.03,20.33 JM1.2 | 76.53,20.42 76.53,17.77 | 76.53,17.77 76.53,14.67 78.53,12.67 IR1.2 | 55.9,22.8 55.93,22.82 | 74.03,45.3 C6.2 | U1.39_12 38.15,44.67 37.53,44.67 U1.39_1 37.53,44.55 37.53,44.05 U1.39_10 | C6.2 73.38,45.93 v73.38,48.62 | v73.38,48.62 73.38,48.67 | 55.9,22.92 55.9,22.8 | v77.48,17.72 77.43,17.77 76.53,17.77 | U3.2 64.15,45.19 63.66,45.68 63.66,47.24 v63.55,47.35 | I2C.2 26,27.95 26.58,27.37 26.58,19.02 R19.2 | I2C.2 23.85,27.92 21.43,27.92 20.48,26.97 R20.2 | R21.2 20.63,49.42 24.88,53.67 24.88,55.17 | R22.2 21.58,56.72 23.13,55.17 24.88,55.17 | 24.88,55.17 26.13,55.17 | 26.13,55.17 27.58,56.62 C5.2
  pour Top: 58.17,64.27 76.96,64.27 78.74,62.49 78.74,48.52 76.96,46.75 57.31,46.75 57.31,63.42
  pour Bottom: 77.37,33.64 80.01,31 80.01,23.89 73.6,17.48 61.27,17.48 55.88,22.87 55.88,30.49 59.03,33.64
IO0  (via drill 0.5)
  Top 0.305: v67,41.05 66.93,41.12 55.2,41.12 v55.05,40.97 | v48.23,30.07 50.73,30.07 53.68,33.02 v53.73,33.02
  Bottom 0.305: Q2.3 68.86,41.05 v67,41.05 | v55.05,40.97 52.78,38.7 52.78,33.97 v53.73,33.02 | v48.23,30.07 48.25,30.1 48.25,33.34 U1.25
IO5
  Bottom 0.305: U1.29 43.15,33.42 43.15,27.92 40.15,24.92 IO5.1
IO12  (via drill 0.5)
  Top 0.305: v50.6,53.27 50.73,53.15 v54.15,53.15
  Bottom 0.305: R8.2 51.88,54.57 53.3,53.15 v54.15,53.15 55.05,52.25 55.05,46.65 56.29,45.41 56.29,39.64 54.28,37.62 54.28,35.05 56.15,33.17 59.83,33.17 61.47,31.53 U2.15 | U1.14 48.33,51 v50.6,53.27
IO13  (via drill 0.5)
  Top 0.305: v55.6,53.37 55.6,50.2 v53.3,47.9 | v55.4,37.17 56.4,36.17 68.9,36.17 74.15,30.92 U2.10
  Bottom 0.305: v53.3,47.9 51.75,47.9 50.28,46.42 49.4,46.42 U1.16 | v55.4,37.17 56.28,37.17 57.13,38.02 57.13,45.8 55.7,47.22 55.7,53.27 v55.6,53.37 55.65,53.42 55.65,56.65 54.63,57.67 52.63,57.67 51.88,58.42 R9.2
IO14  (via drill 0.5)
  Top 0.305: v49.65,25.17 59.53,25.17 61.4,23.3 U2.2
  Bottom 0.305: R7.2 51.9,63.05 52.65,63.8 52.65,65.42 53.28,66.05 53.28,67.17 52.9,67.55 51.08,67.55 50.13,66.59 50.13,54.4 47.15,51.42 47.15,50.42 U1.13 47.15,50.3 47.15,36.17 48.25,35.08 48.77,35.08 50.15,33.7 50.15,25.67 v49.65,25.17
IO15  (via drill 0.5)
  Top 0.305: v49.28,22.3 40.15,22.3 IO15.1
  Bottom 0.305: v49.28,22.3 51.4,24.42 51.4,37 50.98,37.42 49.4,37.42 U1.23
IO26  (via drill 0.5)
  Top 0.305: v42.63,57.9 41.6,58.92 IO26.1
  Bottom 0.305: U1.11 44.52,51.8 43.23,53.1 43.23,57.3 v42.63,57.9
IO27  (via drill 0.5)
  Top 0.305: v45.8,54.27 44.58,53.05 33.48,53.05 30.15,49.72 30.15,34.17 31.65,32.67 35.28,32.67 41.65,26.3 71.15,26.3 74.15,23.3 U2.7
  Bottom 0.305: 45.78,54.27 U1.12 | 45.78,54.27 45.78,55.8 45.28,56.3 R6.2 | v45.8,54.27 45.78,54.27
IO32  (via drill 0.5)
  Top 0.305: v21.65,18.92 20.78,18.05 17.78,18.05 LED6.A
  Bottom 0.305: v21.65,18.92 R19.1 24.58,17.57 25.28,16.87 27.58,16.87 28.23,17.52 28.23,31.32 27.35,32.2 24.95,32.2 24.15,33 24.15,51.17 24.8,51.82 29.88,51.82 30.63,51.07 30.7,51.07 30.79,50.98 30.79,49.36 31.28,48.87 40.4,48.87 40.7,49.17 U1.8
IO33  (via drill 0.5)
  Top 0.305: LED7.A 10.9,30.05 12.4,30.05 v16.53,25.92 16.65,25.92 19.9,29.17 29.67,29.17 v29.76,29.09
  Bottom 0.305: v16.53,25.92 R20.1 | v29.76,29.09 30.91,30.24 30.91,44.85 34.07,48.01 40.84,48.01 41.95,49.12 41.95,50.42 U1.9
IO34  (via drill 0.5)
  Top 0.305: LED8.A 9.61,44.25 14.1,44.25 v14.13,44.22 14.13,47.9 20.7,54.47 36.8,54.47 37.6,55.27 v38.15,55.27
  Bottom 0.305: R21.1 15.58,45.67 v14.13,44.22 | v38.15,55.27 38.15,50.42 U1.6
IO36  (via drill 0.5)
  Top 0.305: LED9.A 16.63,60.92 26.65,60.92 v26.78,60.8 26.98,60.8 31.83,55.95 v34.43,55.95
  Bottom 0.305: R22.1 24.58,58.42 26.78,60.62 v26.78,60.8 | v34.43,55.95 34.43,53.15 35.58,52 35.58,50.42 U1.4
IO39
  Bottom 0.305: LED10.A 22.25,73.5 27.58,68.17 R23.1 27.65,67.55 27.65,68.37 28.08,68.8 34.65,68.8 39.65,63.8 39.65,62.05 37.03,59.42 37.03,50.55 U1.5
IR1  (via drill 0.5)
  Top 0.305: v42.03,28.67 43.78,26.92 75.28,26.92 78.65,23.55 v78.65,22.67
  Bottom 0.305: v42.03,28.67 42.03,33.42 U1.30 | v78.65,22.67 79.15,22.17 79.15,15.55 79.78,14.92 IR1.3
IR2  (via drill 0.5)
  Top 0.305: v40.55,29.22 41.55,30.22 43.1,30.22 45.78,27.55 v77.78,27.55
  Bottom 0.305: U1.31 40.65,33.36 40.65,29.32 v40.55,29.22 | v77.78,27.55 79.15,28.92 79.15,65.25 81.78,67.87 81.78,69.92 78.4,73.3 77.28,73.3 IR2.3
IRTX  (via drill 0.5)
  Top 0.305: v21,32.72 29.39,32.72 32.63,29.48 v32.63,26.78
  Bottom 0.305: v21,32.72 20.45,32.17 20.45,29.95 RB.2 | v32.63,26.78 33.03,27.18 33.03,33.42 U1.37
LEDS
  Bottom 0.305: CHARGING.4-DIN 47.03,69.8 41.5,64.27 41.5,53.07 43.15,51.42 43.15,50.42 U1.10
M1A
  Bottom 0.305: C9.1 67.65,19.42 67.65,20.67 67.28,21.05 64.88,21.05 | JM1.1 63.48,18.27 63.48,20.27 64.25,21.05 64.88,21.05 | 64.18,23.08 U2.3 64.88,22.38 64.88,21.05
M1B
  Bottom 0.305: JM1.6 73.03,18.05 71.65,19.42 C9.2 71.65,19.55 71.65,23.17 U2.6
M2A  (via drill 0.5)
  Top 0.305: v60.15,43.05 62.15,45.05 78.03,45.05 79.4,46.42 79.4,62.8 77.28,64.92 75.65,64.92 73.03,67.55 JM2.1
  Bottom 0.305: C10.1 66.78,26.92 63.9,29.8 63.9,30.8 U2.14 63.9,30.92 63.9,31.67 60.15,35.42 v60.15,43.05
M2B  (via drill 0.5)
  Top 0.305: v57.4,35.05 59.78,32.67 69.78,32.67 71.53,30.92 U2.11
  Bottom 0.305: C10.2 71.53,29.67 71.53,30.8 U2.11 | JM2.6 65.53,67.55 62.03,64.05 62.03,59.17 59.45,56.6 58.58,56.6 57.4,55.42 57.4,48.22 58.68,46.95 58.68,36.27 57.45,35.05 v57.4,35.05
N$1
  Top 0.305: 81.4,39.42 F1.1
  Top 0.508: BT1.+ 78.9,41.92 81.4,39.42
  Bottom 0.305: 76.78,41.92 BT1.+
  Bottom 0.508: CHG+.P$1 77.73,52.72 77.73,42.87 76.78,41.92
N$3
  Bottom 0.508: F1.2 81.41,56.36 SW1.C
N$4
  Bottom 0.305: U4.3 69.65,58.67 69.65,54.17 68.28,52.8 67.78,52.8 D2.ANODE 67.78,52.92 67.4,53.3 67.4,62.75 66.13,64.02 64.08,64.02 62.9,62.85 62.9,52.67 63.53,52.05 L1.2
N$6  (via drill 0.5)
  Top 0.305: v21.28,62.92 18.4,65.8 17.78,65.8 LED5.A
  Bottom 0.305: v21.28,62.92 R18.1
N$7
  Bottom 0.305: R17.1 18.53,53.92 15.03,57.42 11.45,57.42 10.65,56.62 10.65,53.92 10.78,53.8 LED4.A
N$8  (via drill 0.5)
  Top 0.305: v12.65,34.42 9.53,37.55 7.65,37.55 LED3.A
  Bottom 0.305: v12.65,34.42 R16.1
N$9  (via drill 0.5)
  Top 0.305: v81.78,32.67 81.78,35.12 78.33,38.57 69.4,38.57 67.63,36.8 57.45,36.8 53.48,40.77 53.48,43.07 v54.98,44.57
  Bottom 0.305: v81.78,32.67 81.93,32.52 81.93,29.92 81.48,29.47 81.48,27.55 80.4,26.47 80.4,21.17 81.03,20.55 81.15,20.55 81.28,20.42 81.4,20.42 81.9,19.92 81.9,19.17 81.78,19.05 81.78,18.92 81.65,18.8 81.65,18.67 81.4,18.42 81.4,13.32 79.75,11.67 79.75,10.67 78.13,9.05 76.78,9.05 75.9,9.92 75.9,11.37 74.48,12.8 58.28,12.8 57.15,13.92 52.03,13.92 STATE.4-DIN | v54.98,44.57 54.98,45.72 54.43,46.27 54.43,51.05 50.75,54.72 50.75,64.02 51.9,65.17 51.9,66.55 CHARGING.2-DOUT
N$11
  Bottom 0.305: LED1.A 22.28,10.42 22.4,10.55 22.4,11.57 23.63,12.8 28.85,12.8 29.48,13.42 R14.1
N$12
  Bottom 0.305: Q1.1 65.78,39.3 62.78,36.3 62.78,35.92 R4.2
N$14
  Bottom 0.305: R15.1 15.28,21.92 15.28,22.3 LED2.A
N$15
  Bottom 0.305: Q2.1 70.28,39.3 68.4,37.42 68.4,35.92 R5.2
N$19
  Top 0.305: Q3.2 9.4,41.92 7.65,40.17 LED3.K | LED5.K 19.03,67.92 18.4,67.3 17.15,67.3 15.53,65.67 15.53,63.8 12.15,60.42 12.15,56.05 LED4.K
  Bottom 0.305: LED1.K 20.9,12.55 19.93,12.55 16.28,16.2 16.28,18.55 13.83,21 13.83,24.47 13.9,24.55 LED2.K 13.9,24.67 13.53,25.05 13.53,31.92 11.4,34.05 11.4,36.3 7.65,40.05 LED3.K 7.65,40.17 12.28,44.8 12.28,55.8 12.15,55.92 LED4.K
N$26
  Bottom 0.305: RB.1 18.65,29.92 18.65,38.55 18.03,39.17 Q3.1
RTS  (via drill 0.5)
  Top 0.305: v73.5,34.65 75.75,36.9 78.55,36.9 80.42,35.03 | 80.42,35.03 80.52,34.93 | v80.33,34.94 80.42,35.03
  Bottom 0.305: Q1.2 61.53,36.92 61.53,34.92 61.9,34.55 70.28,34.55 R5.1 | R5.1 | v73.5,34.65 71.55,34.65 R5.1 | v80.33,34.94 83.26,37.87 83.26,40.72 83.66,41.13 85.09,41.13 85.72,40.49 85.72,34.46 90.42,29.76 90.42,28.48 86.73,22.09 85.13,20.49 84.14,20.49 PROGRAMMER.3
RXD  (via drill 0.5)
  Top 0.305: v49.08,19.87 50,20.8 50.01,20.81 65.88,20.81 66.04,20.65 79.13,20.65 80.49,22 80.49,27.88 81.48,28.88 84.96,28.88 85.57,28.27 PROGRAMMER.10
  Bottom 0.305: v49.08,19.87 47.38,18.17 42.4,18.17 35.78,24.8 35.78,33.3 35.65,33.42 U1.35
SCL  (via drill 0.5)
  Top 0.305: v34.3,25.58 34.14,25.42 23.9,25.42 I2C.3
  Bottom 0.305: v34.3,25.58 34.3,33.42 U1.36
SDA  (via drill 0.5)
  Top 0.305: v38.15,26.55 34.53,22.92 23.9,22.92 I2C.4
  Bottom 0.305: v38.15,26.55 38.15,33.42 U1.33
TOUCH1  (via drill 0.5)
  Top 0.305: v55.4,35.55 55.4,32.8 51.28,28.67 v48.58,28.67 | v55.03,65.55 33.9,65.55 T1.P$2
  Bottom 0.305: v48.58,28.67 48.08,28.17 48.08,24.77 48.8,24.05 50.15,24.05 50.78,24.67 50.78,34.8 49.4,36.17 U1.24 | v55.03,65.55 55.03,63.97 56.73,62.27 56.73,47.67 57.93,46.47 57.93,37.17 56.3,35.55 v55.4,35.55
TOUCH2  (via drill 0.5)
  Top 0.305: v44.4,19.3 43.4,18.3 33.9,18.3 T2.P$2
  Bottom 0.305: v44.4,19.3 46.9,21.8 46.9,33.3 47.03,33.42 U1.26
TXD  (via drill 0.5)
  Top 0.305: v37.03,29.3 40.15,26.17 40.9,26.17 43.65,23.42 56.4,23.42 58.4,21.42 78.98,21.42 79.77,22.21 79.77,22.24 79.85,22.32 79.85,23.19 79.42,23.62 79.42,26.82 v79.27,26.97 | v80.64,30.81 82.74,30.81 82.79,30.86 82.79,30.87 v84.78,32.86
  Bottom 0.305: v37.03,29.3 37.03,33.3 U1.34 | v84.78,32.86 84.78,32.51 84.35,32.07 84.35,26.02 PROGRAMMER.8 | v80.64,30.81 79.85,30.01 79.85,27.1 79.72,26.97 v79.27,26.97
VCC  (via drill 0.5)
  Top 0.305: 49,62.15 51.28,64.42 57.4,64.42 58.53,65.55 61.9,65.55 65.15,68.8 74.83,68.8 76.75,66.87 79.76,66.87 SW1.A 82.53,63.92 80.47,61.86 80.47,46.23 77.55,43.32 | v62.83,42.25 63.58,43 69.1,43 v69.53,43.42 69.63,43.32 77.55,43.32 | v84.55,39.97 82.55,41.97 81.28,41.97 79.93,43.32 77.55,43.32 | v27.85,65.55 30.7,62.7 48.45,62.7 49,62.15 | 49,62.15 v49,61.5 | v83.03,27.76 82.93,27.76 81.76,26.58 81.76,21.76 PROGRAMMER.4
  Bottom 0.305: v49,61.5 49,62.23 48.23,63 R2.2 | C3.1 71.03,48.55 71.03,45.92 70.4,45.3 C1.1 70.28,45.05 69.53,44.3 v69.53,43.42 | L1.1 59.4,51.92 59.4,49.02 59.95,48.47 64.1,48.47 65.18,47.4 65.18,46.33 64.99,46.14 U3.1 64.9,46.05 65.65,46.05 66.03,45.67 66.03,44.65 65.68,44.3 64.9,44.3 U3.3 64.79,44.2 v62.83,42.25 | v84.55,39.97 84.55,35.65 84.45,35.57 83.66,34.78 83.66,28.39 v83.03,27.76 | v27.85,65.55 27.85,65.32 26.48,63.95 R18.2 26.48,62.25 25.28,61.05 20.35,61.05 19.38,60.07 19.38,56.35 20.4,55.32 20.4,53.92 R17.2 20.4,53.8 20.38,53.77 20.38,52.92 19.05,51.6 15.18,51.6 12.9,49.32 12.9,39.3 17.4,34.8 17.4,34.55 R16.2 17.48,32.7 16.53,31.75 16.53,29.4 15.4,28.27 15.4,25.42 16.84,23.98 19.62,23.98 20.4,23.2 20.4,22.05 R15.2 20.53,21.92 20.53,17.47 23.08,14.92 R14.2
(copper drawn outside any net)
  shapes: Top circle x4

### Text on the board
Top: SWARMESH 2020 / 2020/06/26 / v1.0.2
tPlace: D0 | M2 VCC C2 C1 GND M1 | ON | - | RESET | + | OFF | GND | GND | SDA SCL GND | DTR | RTS | D0 | M1 GND C1 C2 VCC M2
bPlace: POWER